# EAGLE design AstroEQ SMD V4.8 (EQ5) (EAGLE 6.6.0)
REVISION: V4.8
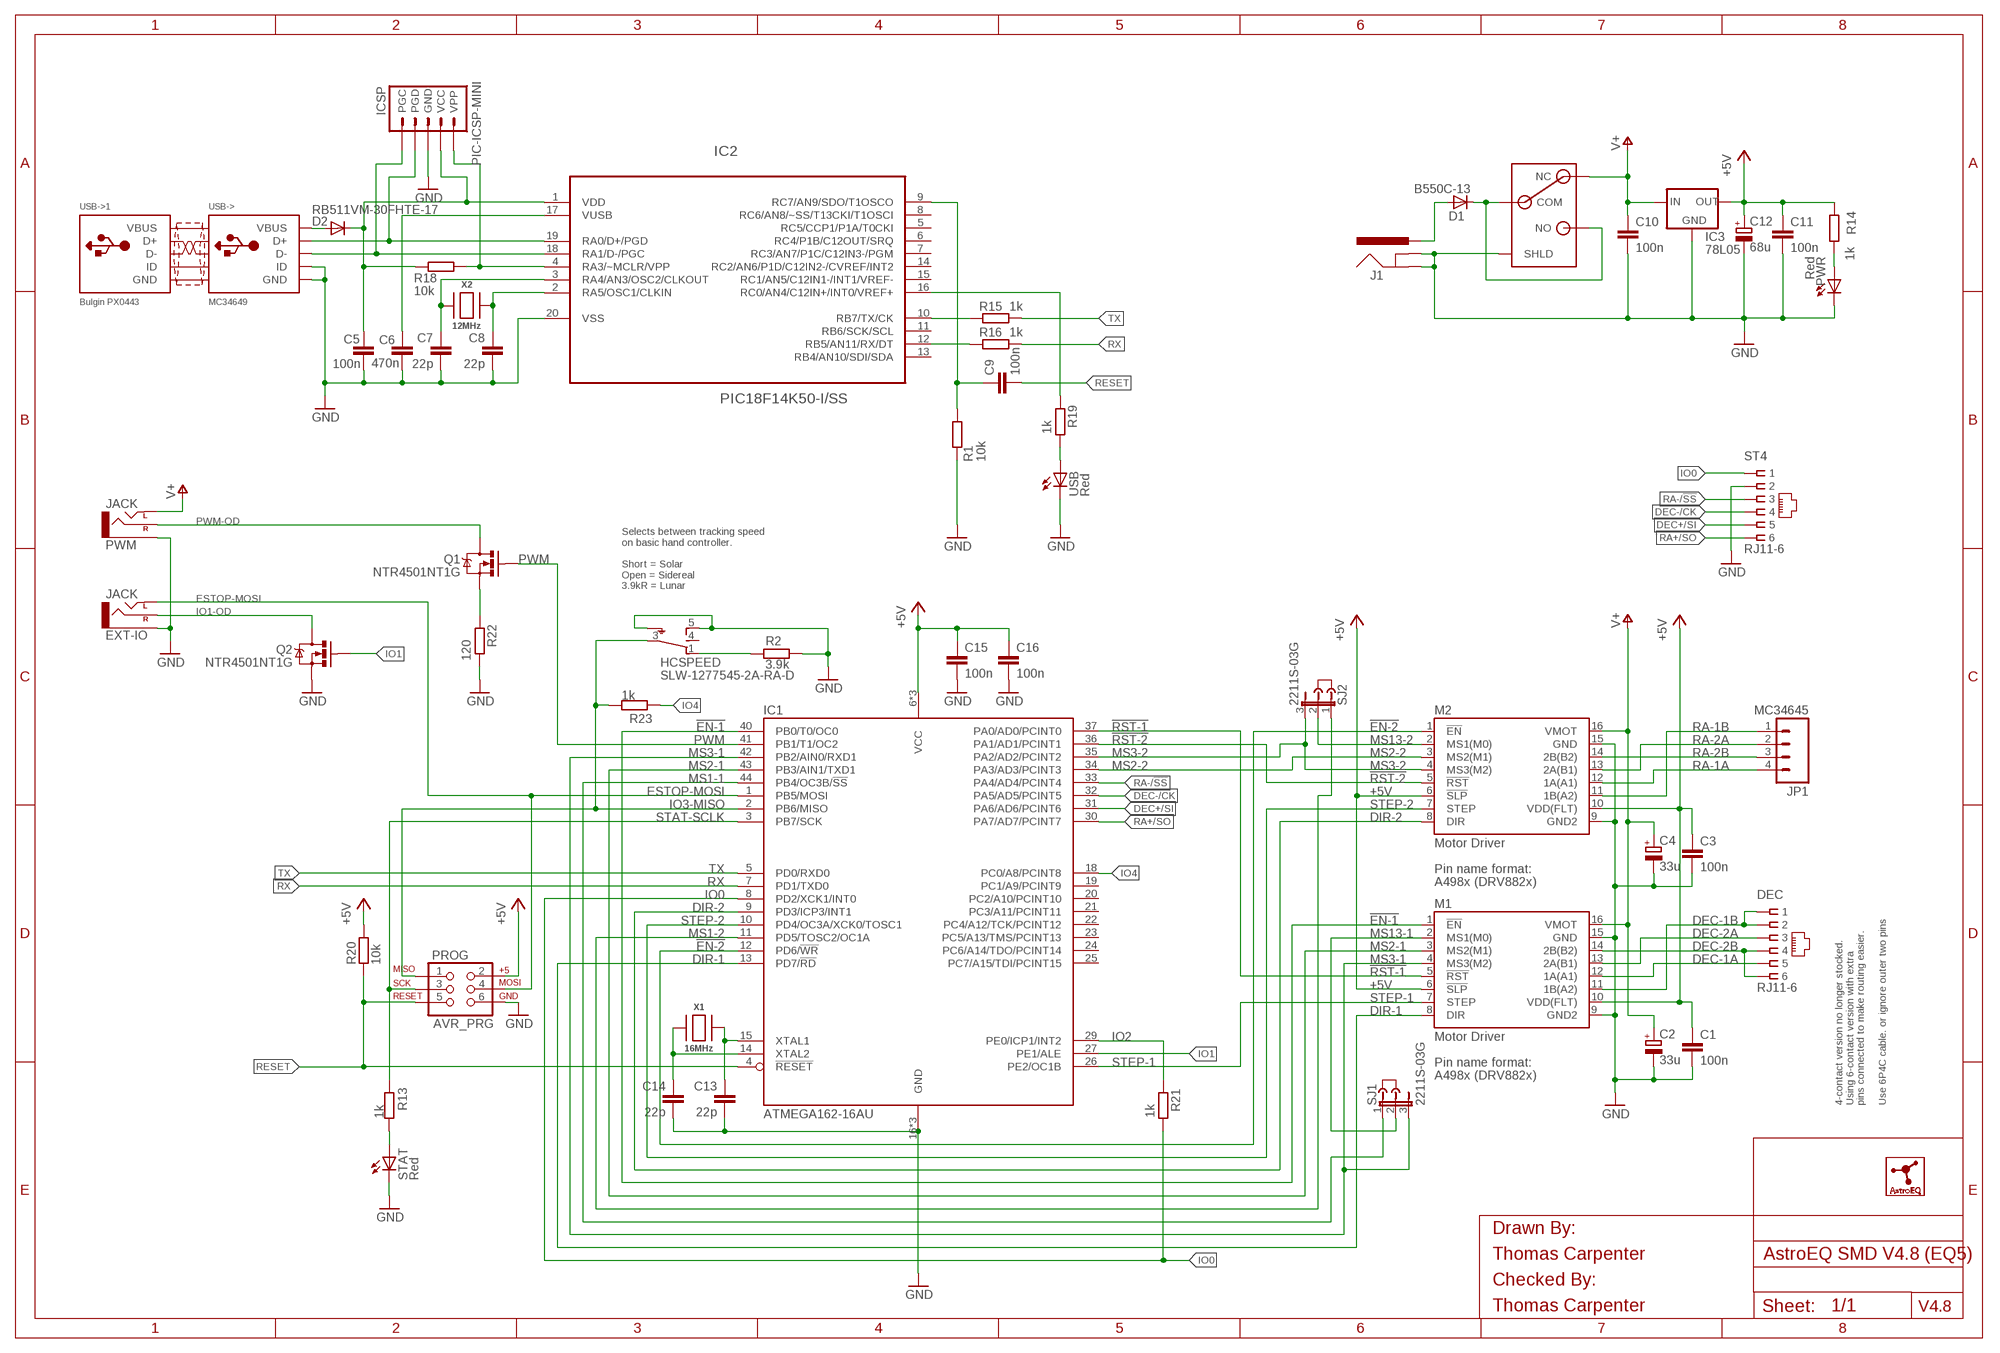
[diagram p0: schematic, sheet 1]
FRAME1 (A3L-LOC): CHECKED_BY: Thomas Carpenter; DRAWN_BY: Thomas Carpenter
USB->1 (USB-PANEL): MF: BULGIN; MPN: PX0443; OC_FARNELL: 1229685

## Parts
C1  100n  C-EUC0603  [C0603]
C2  33u  CPOL-EUSMCC  [SMC_C]
C3  100n  C-EUC0603  [C0603]
C4  33u  CPOL-EUSMCC  [SMC_C]
C5  100n  C-EUC0603  [C0603]
C6  470n  C-EUC0603  [C0603]
C7  22p  C-EUC0603  [C0603]
C8  22p  C-EUC0603  [C0603]
C9  100n  C-EUC0603  [C0603]
C10  100n  C-EUC0603  [C0603]
C11  100n  C-EUC0603  [C0603]
C12  68u  CPOL-EUSMCC  [SMC_C]
C13  22p  C-EUC0603  [C0603]
C14  22p  C-EUC0603  [C0603]
C15  100n  C-EUC0603  [C0603]
C16  100n  C-EUC0603  [C0603]
D1  B550C-13  DIODE-SMC  [SMC]
D2  RB511VM-30FHTE-17  DIODESOD  [SOD-323]
DEC  RJ11-6  RJ11-2L-B  [RJ11-NO_SHIELD]
EXT-IO  JACK  AUDIO-JACKVERT  [AUDIO-JACK-3.5MM-VERT]
HCSPEED  SLW-1277545-2A-RA-D  [SLW-127]
IC1  ATMEGA162-16AU  [TQFP44]
IC2  PIC18F14K50-I/SS  [SS20]
IC3  78L05  78LXXSOT-23  [SOT23]
ICSP  PIC-ICSP-MINI  [PIC-ICSP-MINI]
J1  POWER_JACKPANEL  [POWER_JACK_PANEL]
J2  DNI  JUMPER  [JUMP]
J3  DNI  JUMPER  [JUMP]
JP1  MC34645  M04POLAR  [MOLEX-1X4]
LOGO1  ASTROEQ5MM  [ASTROEQ-SMALL]
M1  Motor Driver  A4983CARRIER  [DIP16-W]
M2  Motor Driver  A4983CARRIER  [DIP16-W]
PROG  AVR_PRG  AVR_SPI_PRG_6PTH  [2X3]
PWM  JACK  AUDIO-JACKVERT  [AUDIO-JACK-3.5MM-VERT]
PWR  Red  LED3MM  [LED3MM]
PWR-SW  SWITCH  [SPST]
Q1  NTR4501NT1G  MOSFET-NCHANNELSMD  [SOT23-3]
Q2  NTR4501NT1G  MOSFET-NCHANNELSMD  [SOT23-3]
R1  10k  R-EU_R0603  [R0603]
R2  3.9k  R-EU_R0603  [R0603]
R13  1k  R-EU_R0603  [R0603]
R14  1k  R-EU_R0603  [R0603]
R15  1k  R-EU_R0603  [R0603]
R16  1k  R-EU_R0603  [R0603]
R18  10k  R-EU_R0603  [R0603]
R19  1k  R-EU_R0603  [R0603]
R20  10k  R-EU_R0603  [R0603]
R21  1k  R-EU_R0603  [R0603]
R22  120  R-EU_R0805  [R0805]
R23  1k  R-EU_R0603  [R0603]
SJ1  2211S-03G  JP2E  [JP2]
SJ2  2211S-03G  JP2E  [JP2]
ST4  RJ11-6  RJ11-2L-B  [RJ11-NO_SHIELD]
STAT  Red  LED3MM  [LED3MM]
USB  Red  LED3MM  [LED3MM]
USB->  MC34649  USBBULGINWIRE  [22-23-2051]
X1  16MHz  XTALNX5032  [NX5032]
X2  12MHz  XTALNX5032  [NX5032]

## Nets
!EN-1: IC1.40(PB0/T0/OC0) M1.1(!EN)
!EN-2: IC1.12(PD6/!WR) M2.1(!EN)
!RST-1: IC1.37(PA0/AD0/PCINT0) M1.5(!RST)
!RST-2: IC1.36(PA1/AD1/PCINT1) M2.5(!RST)
+5V: C1.1 C3.1 C11.1 C12.+ C15.1 C16.1 IC1.6(VCC) IC1.17(VCC) IC1.38(VCC) IC3.1(OUT) M1.6(!SLP) M1.10(VDD(FLT)) M2.6(!SLP) M2.10(VDD(FLT)) PROG.2 R14.1 R20.2
AVROSC1: C13.1 IC1.15(XTAL1) X1.1
AVROSC2: C14.1 IC1.14(XTAL2) X1.2
D_N [usbdat]: IC2.18(RA1/D-/PGC) ICSP.5(PGC) USB->.2(D-)
D_P [usbdat]: IC2.19(RA0/D+/PGD) ICSP.4(PGD) USB->.3(D+)
DEC+/SI: IC1.31(PA6/AD6/PCINT6) ST4.5
DEC-1A: DEC.5 M1.12(1A(A1))
DEC-1B: DEC.1 DEC.2 M1.11(1B(A2))
DEC-2A: DEC.3 M1.13(2A(B1))
DEC-2B: DEC.4 DEC.6 M1.14(2B(B2))
DEC-/CK: IC1.32(PA5/AD5/PCINT5) ST4.4
DIR-1: IC1.13(PD7/!RD) M1.8(DIR)
DIR-2: IC1.9(PD3/ICP3/INT1) M2.8(DIR)
DTR: C9.1 IC2.9(RC7/AN9/SDO/T1OSCO) R1.1
ESTOP-MOSI: EXT-IO.2(LEFT) IC1.1(PB5/MOSI) PROG.4
GND: C1.2 C2.- C3.2 C4.- C5.2 C6.1 C7.2 C8.2 C10.2 C11.2 C12.- C13.2 C14.2 C15.2 C16.2 EXT-IO.1(SLEEVE) HCSPEED.5(O) HCSPEED.S1(SH) HCSPEED.S2(SH) IC1.16(GND) IC1.28(GND) IC1.39(GND) IC2.20(VSS) IC3.3(GND) ICSP.3(GND) J1.SHUNT(GNDBREAK) J1.SLEEVE(GND) M1.9(GND2) M1.15(GND) M2.9(GND2) M2.15(GND) PROG.6 PWM.1(SLEEVE) PWR-SW.S1(SHLD) PWR-SW.S2(SHLD) PWR-SW.S3(SHLD) PWR-SW.S4(SHLD) PWR.K(C) Q2.2(S) R1.2 R2.2 R22.1 ST4.2 STAT.K(C) USB->.4(GND) USB->.5(ID) USB.K(C)
IO0: IC1.8(PD2/XCK1/INT0) R21.1 ST4.1
IO1: IC1.27(PE1/ALE) Q2.1(G)
IO1-OD: EXT-IO.3(RIGHT) Q2.3(D)
IO2: IC1.29(PE0/ICP1/INT2) R21.2
IO3-MISO: HCSPEED.3(P) IC1.2(PB6/MISO) PROG.1 R23.2
IO4: IC1.18(PC0/A8/PCINT8) R23.1
MCLR: IC2.4(RA3/~MCLR/VPP) ICSP.1(VPP) R18.1
MS1-1: IC1.44(PB4/OC3B/!SS) SJ1.1
MS1-2: IC1.11(PD5/TOSC2/OC1A) SJ2.1
MS2-1: IC1.43(PB3/AIN1/TXD1) M1.3(MS2(M1))
MS2-2: IC1.34(PA3/AD3/PCINT3) M2.3(MS2(M1))
MS3-1: IC1.42(PB2/AIN0/RXD1) M1.4(MS3(M2)) SJ1.3
MS3-2: IC1.35(PA2/AD2/PCINT2) M2.4(MS3(M2)) SJ2.3
MS13-1: M1.2(MS1(M0)) SJ1.2
MS13-2: M2.2(MS1(M0)) SJ2.2
N$1: HCSPEED.1(S) R2.1
PWM: IC1.41(PB1/T1/OC2) Q1.1(G)
PWM-OD: PWM.3(RIGHT) Q1.3(D)
PWM-RES: Q1.2(S) R22.2
PWRLED: PWR.A R14.2
RA+/SO: IC1.30(PA7/AD7/PCINT7) ST4.6
RA-1A: JP1.4 M2.12(1A(A1))
RA-1B: JP1.1 M2.11(1B(A2))
RA-2A: JP1.2 M2.13(2A(B1))
RA-2B: JP1.3 M2.14(2B(B2))
RA-/!SS: IC1.33(PA4/AD4/PCINT4) ST4.3
RESET: C9.2 IC1.4(!RESET) PROG.5 R20.1
RX: IC1.7(PD1/TXD0) R16.1
RX(USB): IC2.12(RB5/AN11/RX/DT) R16.2
STAT-SCLK: IC1.3(PB7/SCK) PROG.3 R13.1
STATLED: R13.2 STAT.A
STEP-1: IC1.26(PE2/OC1B) M1.7(STEP)
STEP-2: IC1.10(PD4/OC3A/XCK0/TOSC1) M2.7(STEP)
SWITCH: D1.C PWR-SW.COM PWR-SW.NO
TX: IC1.5(PD0/RXD0) R15.1
TX(USB): IC2.10(RB7/TX/CK) R15.2
USBLED: R19.1 USB.A
USBOSC1: C8.1 IC2.2(RA5/OSC1/CLKIN) X2.2
USBOSC2: C7.1 IC2.3(RA4/AN3/OSC2/CLKOUT) X2.1
USBSTAT: IC2.16(RC0/AN4/C12IN+/INT0/VREF+) R19.2
V+: C2.+ C4.+ C10.1 IC3.2(IN) M1.16(VMOT) M2.16(VMOT) PWM.2(LEFT) PWR-SW.NC
VBUS: D2.2(A) USB->.1(VBUS)
VIN: D1.A J1.CENTRE(PWR)
VPIC: C5.1 D2.1(C) IC2.1(VDD) ICSP.2(VCC) R18.2
VUSB: C6.2 IC2.17(VUSB)
Unconnected: HCSPEED.4(M) IC1.19(PC1/A9/PCINT9) IC1.20(PC2/A10/PCINT10) IC1.21(PC3/A11/PCINT11) IC1.22(PC4/A12/TCK/PCINT12) IC1.23(PC5/A13/TMS/PCINT13) IC1.24(PC6/A14/TDO/PCINT14) IC1.25(PC7/A15/TDI/PCINT15) IC2.5(RC5/CCP1/P1A/T0CKI) IC2.6(RC4/P1B/C12OUT/SRQ) IC2.7(RC3/AN7/P1C/C12IN3-/PGM) IC2.8(RC6/AN8/~SS/T13CKI/T1OSCI) IC2.11(RB6/SCK/SCL) IC2.13(RB4/AN10/SDI/SDA) IC2.14(RC2/AN6/P1D/C12IN2-/CVREF/INT2) IC2.15(RC1/AN5/C12IN1-/INT1/VREF-)

## Notes on the sheet
- Selects between tracking speed
  on basic hand controller.
  
  Short = Solar
  Open = Sidereal
  3.9kR = Lunar
- 4-contact version no longer stocked.
  Using 6-contact version with extra
  pins connected to make routing easier.
  
  Use 6P4C cable. or ignore outer two pins

## Library data of the parts
C1 C3 C5 C9-C11 C15 C16 = rcl:C-EU: CAPACITOR, European symbol; MF: MULTICOMP; MPN: MC0603F104Z250CT; OC_FARNELL: 1759038
C2 C4 = rcl:CPOL-EU: POLARIZED CAPACITOR, European symbol; MF: KEMET; MPN: T491C336K025AT; OC_FARNELL: 1793896
C6 = rcl:C-EU: CAPACITOR, European symbol; MF: MULTICOMP; MPN: MC0603F474Z160CT; OC_FARNELL: 1759021
C7 C8 C13 C14 = rcl:C-EU: CAPACITOR, European symbol; MF: MULTICOMP; MPN: MC0603N220J500CT; OC_FARNELL: 1759057
C12 = rcl:CPOL-EU: POLARIZED CAPACITOR, European symbol; MF: AVX; MPN: TPSC686K016R0125; OC_FARNELL: 1658976
D1 = diode:DIODE-: DIODE; MF: DIODES INC.; MPN: B550C-13-F; OC_FARNELL: 1858608
D2 = SparkFun:DIODE: Diode These are standard reverse protection diodes and small signal diodes. SMA package can handle up to about 1A. SOD-323 can handle about 200mA. What the SOD-323 package when ordering, there are some mfgs out there that are 5-pin packages.; MF: ROHM; MPN: RB511VM-30FHTE-17; OC_FARNELL: 2581544
DEC ST4 = con-tycoelectronics:RJ11: CORCOM Modular RJ Jacks No Shield Source: www.tycoelectronics.com .. ENG_DS_1654001_1099_RJ_L_0507.pdf; MF: MOLEX; MPN: 95503-2661; OC_FARNELL: 1620210
EXT-IO PWM = SparkFun:AUDIO-JACK: 3.5mm Audio Jack Simple 3.5mm common PCB mount audio jack. SKU: PRT-08032; MANUFACTURER: LUMBERG; MF: LUMBERG; MPN: 1502 01; OC_FARNELL: 1243242
HCSPEED = switch:SLW-127
IC1 = atmel:ATMEGA162: 8-bit RISC MICROCONTROLLER 16K Bytes internal flash program memory 1K Bytes internal SRAM Upto 64K Bytes optional external memory space 512 Bytes EEPROM Two 8-bit timers Two 16-bit timers Dual programmable serial USARTs Master/Slave serial SPI interface Source: ATMEGA162_DIP40.lbr; MF: ATMEL; MPN: ATMEGA162-16AU; OC_FARNELL: 9171150
IC2 = microchip:PIC18F14K50: USB Flash Microcontrollers; MF: MICROCHIP
IC3 = v-reg:78LXX: VOLTAGE REGULATOR; MF: TAIWAN SEMICONDUCTOR; MPN: TS78L05CX RFG; OC_FARNELL: 1476698
ICSP = SparkFun:PIC-ICSP-MINI: PIC-ICSP-Mini Miniature 5-pin connection for temporary programming of PICs. Use this device in your design to save space. Program the PIC with this adapter Spark Fun Electronics SKU : BOB-00194; OC_FARNELL: unknown
J1 = SparkFun:POWER_JACK: Power Jack This is the standard 5.5mm barrel jack for power. The PTH is the most common, proven, reliable, footprint. All others are experimental. The Slot footprint only works if the mill layer is transmitted to the PCB fab house so be warned. Spark Fun Electronics SKU : PRT-00119. Mating wall wart : TOL-00298 (and others); MF: SWITCHCRAFT; MPN: PCL712AS; OC_FARNELL: 1871167
J2 J3 = jumper:JUMPER: JUMPER header; MF: 3M; MPN: 969102-0000-DA; OC_FARNELL: 2579814
JP1 = SparkFun:M04: Header 4 Standard 4-pin 0.1" header. Use with straight break away headers (SKU : PRT-00116), right angle break away headers (PRT-00553), swiss pins (PRT-00743), machine pins (PRT-00117), and female headers (PRT-00115). Molex polarized connector foot print use with SKU : PRT-08231 with associated crimp pins and housings. 1MM SMD Version SKU: PRT-10208; MF: MULTICOMP; MPN: MC34645; OC_FARNELL: 1675775
LOGO1 = AstroEQTooth:ASTROEQ; OC_FARNELL: unknown
M1 M2 = A4983Carrier:A4983CARRIER; MF: SAMTEC; MPN: CES-116-01-T-S; OC_FARNELL: 1667522
PROG = SparkFun:AVR_SPI_PRG_6: AVR ISP 6 Pin This is the reduced ISP connector for AVR programming. Common on Arduino. This footprint will take up less PCB space and can be used with a 10-pin to 6-pin adapter such as SKU: BOB-08508; MF: AMP - TE CONNECTIVITY; MPN: 826632-3; OC_FARNELL: 3418492
PWR STAT USB = led:LED: LED OSRAM: - CHIPLED LG R971, LG N971, LY N971, LG Q971, LY Q971, LO R971, LY R971 LH N974, LH R974 LS Q976, LO Q976, LY Q976 LO Q996 - Hyper CHIPLED LW Q18S LB Q993, LB Q99A, LB R99A - SideLED LS A670, LO A670, LY A670, LG A670, LP A670 LB A673, LV A673, LT A673, LW A673 LH A674 LY A675 LS A676, LA A676, LO A676, LY A676, LW A676 LS A679, LY A679, LG A679 - Hyper Micro SIDELED® LS Y876, LA Y876, LO Y876, LY Y876 LT Y87S - SmartLED LW L88C, LW L88S LB L89C, LB L89S, LG L890 LS L89K, LO L89K, LY L89K LS L896, LA L896, LO L896, LY L896 - TOPLED LS T670, LO T670, LY T670, LG T670, LP T670 LSG T670, LSP T670, LSY T670, LOP T670, LYG T670 LG T671, LOG T671, LSG T671 LB T673, LV T673, LT T673, LW T673 LH T674 LS T676, LA T676, LO T676, LY T676, LB T676, LH T676, LSB T676, LW T676 LB T67C, LV T67C, LT T67C, LS T67K, LO T67K, LY T67K, LW E67C LS E67B, LA E67B, LO E67B, LY E67B, LB E67C, LV E67C, LT E67C LW T67C LS T679, LY T679, LG T679 LS T770, LO T770, LY T770, LG T770, LP T770 LB T773, LV T773, LT T773, LW T773 LH T774 LS E675, LA E675, LY E675, LS T675 LS T776, LA T776, LO T776, LY T776, LB T776 LHGB T686 LT T68C, LB T68C - Hyper Mini TOPLED® LB M676 - Mini TOPLED Santana® LG M470 LS M47K, LO M47K, LY M47K Source: http://www.osram.convergy.de LUXEON: - LUMILED® LXK2-PW12-R00, LXK2-PW12-S00, LXK2-PW14-U00, LXK2-PW14-V00 LXK2-PM12-R00, LXK2-PM12-S00, LXK2-PM14-U00 LXK2-PE12-Q00, LXK2-PE12-R00, LXK2-PE12-S00, LXK2-PE14-T00, LXK2-PE14-U00 LXK2-PB12-K00, LXK2-PB12-L00, LXK2-PB12-M00, LXK2-PB14-N00, LXK2-PB14-P00, LXK2-PB14-Q00 LXK2-PR12-L00, LXK2-PR12-M00, LXK2-PR14-Q00, LXK2-PR14-R00 LXK2-PD12-Q00, LXK2-PD12-R00, LXK2-PD12-S00 LXK2-PH12-R00, LXK2-PH12-S00 LXK2-PL12-P00, LXK2-PL12-Q00, LXK2-PL12-R00 Source: www.luxeon.com KINGBRIGHT: KA-3528ASYC Source: www.kingbright.com; MF: KINGBRIGHT; MPN: L-424HDT; OC_FARNELL: 1142499
PWR-SW = con-tycoelectronics:SWITCH; MF: TE CONNECTIVITY; MPN: AE101J1V3B004; OC_FARNELL: 1813654
Q1 Q2 = SparkFun:MOSFET-NCHANNEL; MF: ON SEMICONDUCTOR; MPN: NTR4501NT1G; OC_FARNELL: 1431305
R1 R18 R20 = rcl:R-EU_: RESISTOR, European symbol; MF: MULTICOMP; MPN: MCWR06X1002FTL; OC_FARNELL: 2447230
R2 R13-R16 R19 R21 R23 = rcl:R-EU_: RESISTOR, European symbol; MF: MULTICOMP; MPN: MCWR06X1001FTL; OC_FARNELL: 2447272
R22 = rcl:R-EU_: RESISTOR, European symbol; MF: MULTICOMP; MPN: MCWR08X1200FTL; OC_FARNELL: 2447561
SJ1 SJ2 = jumper:JP2E: JUMPER; MF: MULTICOMP; MPN: 2211S-03G; OC_FARNELL: 1593412
USB-> = adafruit:USB: USB Connectors USBMINIB - Surface Mount Female Mini-B USB Connector 4UConnector: 06564 By microbuilder.eu Thru-hole RA Female Mini-B USB Connector 4UConnector: 18732 By ladyada.net; MF: MULTICOMP; MPN: MC34647; OC_FARNELL: 1675776
X1 = adafruit:XTAL: Low cost SMT crystals, no capacitors included http://www.ladyada.net/library/eagle; MF: TXC; MPN: 7A-16.000MAAJ-T; OC_FARNELL: 1841946
X2 = adafruit:XTAL: Low cost SMT crystals, no capacitors included http://www.ladyada.net/library/eagle; MF: TXC; MPN: 7A-12.000MAAJ-T; OC_FARNELL: 1841940

## Net classes
1 power: width 0.61 mm, drill 0.711 mm, clearance 0.203 mm
2 gnd: width 0.305 mm, drill 0.711 mm, clearance 0.203 mm
3 usbvcc: width 0.508 mm, drill 0.711 mm, clearance 0.203 mm
4 usbdat: width 0.406 mm, clearance 0.152 mm

## Board
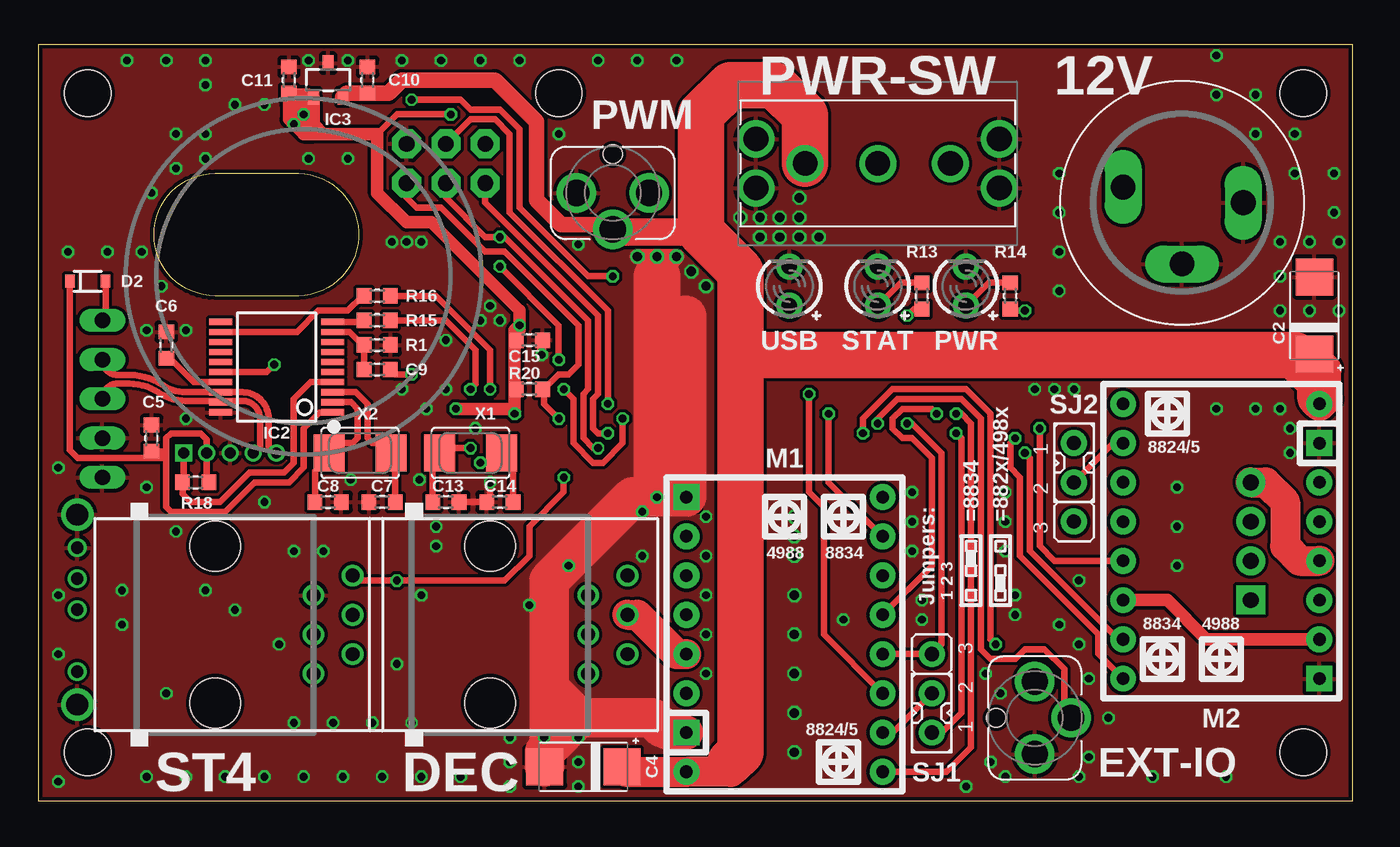
[diagram p1: board, top side]
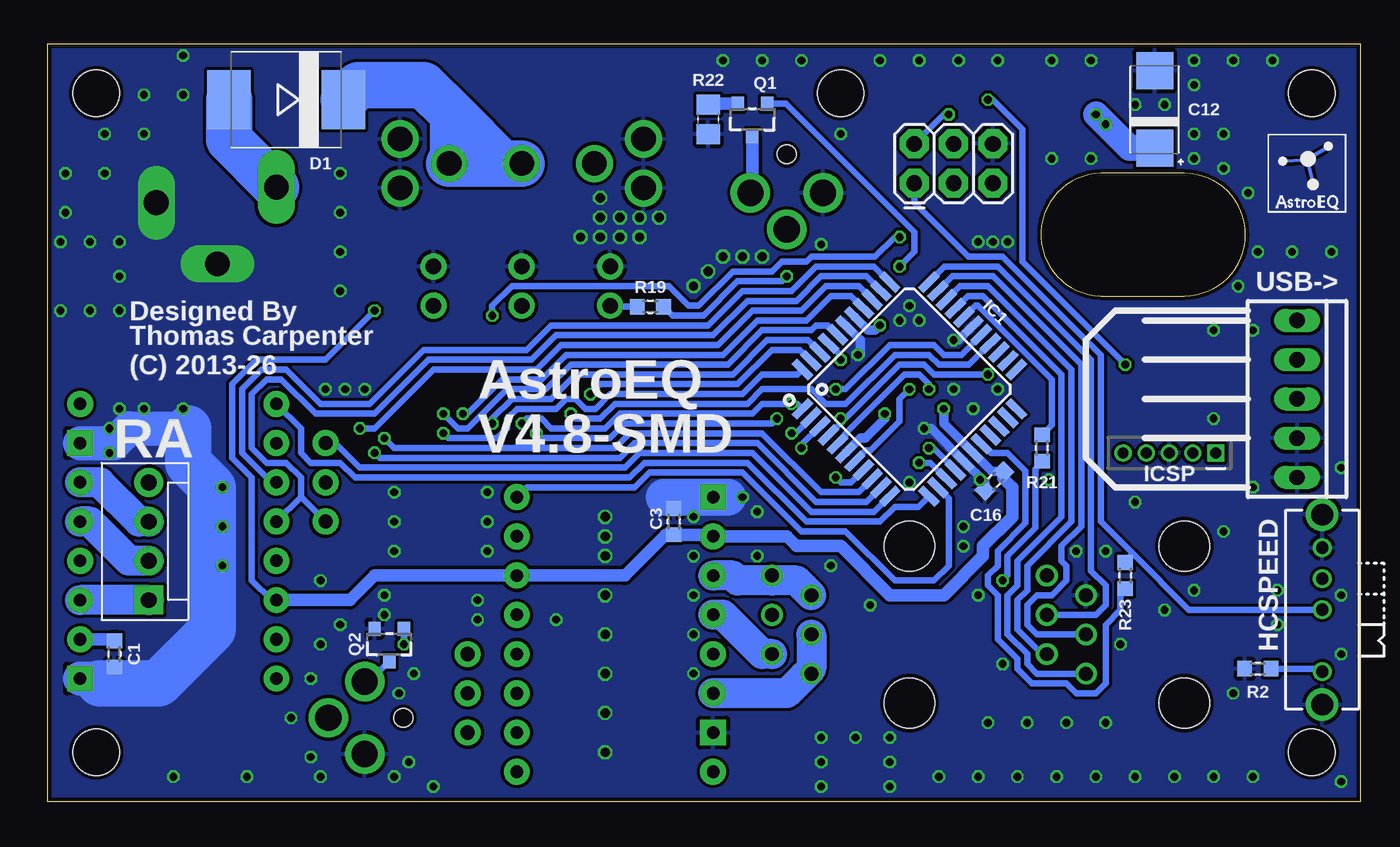
[diagram p2: board, bottom side, seen from below]

Size 85 x 49 mm. Coordinates in mm from the lower left corner, seen from the top.
Outline: 0,0 0,49 85,49 85,0 0,0
Outline: 16.83,40.64 arc-177 16.83,32.7 11.43,32.7 arc-180 11.43,40.64 16.83,40.64
Copper layers (1*16): Top 0.035mm / dielectric 1.5mm / Bottom 0.035mm
Design rules "ITEADstudio_DRC *": minimum track width 6mil, minimum drill 12mil, track to track 6mil, track to pad 6mil, pad to pad 6mil, via to via 6mil, smd to smd 0mil, copper to edge 10mil, drill to drill 10mil, minimum pad ring 8mil, minimum via ring 6mil, stop-mask expansion 2mil, vias tented up to drill 1mm, thermal gap 10mil
Holes 3 mm at 81.83,3.17 33.66,45.83 3.17,45.83 81.83,45.83 3.17,3.17
bKeepout: area 48.3,7.4 to 53.3,12.4

### Footprints (pad centres in the part's own frame; a part is rotated, then mirrored left to right if it is on the bottom)
C0603 = smd 0.95 x 1: 1 -0.85,0; 2 0.85,0
SMC_C = smd 2.4 x 2.4: + -2.5,0; - 2.5,0
SMC = smd 2.8 x 3.8: A 3.7,0; C -3.7,0
SOD-323 = smd 0.63 x 0.83: 1 -1.15,0; 2 1.15,0
RJ11-NO_SHIELD = drill 0.9 pad 1.4: 1 -3.175,8.89; 2 -1.905,6.35; 3 -0.635,8.89; 4 0.635,6.35; 5 1.905,8.89; 6 3.175,6.35 | hole 3.251: -5.08,0; 5.08,0
AUDIO-JACK-3.5MM-VERT = drill 1.7: 1 2.35,0; 2 0,2.35; 3 -2.35,0 | hole 1.2: 0,-2.5
SLW-127 = drill 0.8: 1 -4,0; 3 0,0; 4 2,0; 5 4,0 | drill 1.4: S1 -6.15,0; S2 6.15,0
TQFP44 = smd 1.5 x 0.5: 1 -5.8,4; 2 -5.8,3.2; 3 -5.8,2.4; 4 -5.8,1.6; 5 -5.8,0.8; 6 -5.8,0; 7 -5.8,-0.8; 8 -5.8,-1.6; 9 -5.8,-2.4; 10 -5.8,-3.2; 11 -5.8,-4; 23 5.8,-4; 24 5.8,-3.2; 25 5.8,-2.4; 26 5.8,-1.6; 27 5.8,-0.8; 28 5.8,0; 29 5.8,0.8; 30 5.8,1.6; 31 5.8,2.4; 32 5.8,3.2; 33 5.8,4 | smd 0.5 x 1.5: 12 -4,-5.8; 13 -3.2,-5.8; 14 -2.4,-5.8; 15 -1.6,-5.8; 16 -0.8,-5.8; 17 0,-5.8; 18 0.8,-5.8; 19 1.6,-5.8; 20 2.4,-5.8; 21 3.2,-5.8; 22 4,-5.8; 34 4,5.8; 35 3.2,5.8; 36 2.4,5.8; 37 1.6,5.8; 38 0.8,5.8; 39 0,5.8; 40 -0.8,5.8; 41 -1.6,5.8; 42 -2.4,5.8; 43 -3.2,5.8; 44 -4,5.8
SS20 = smd 0.4 x 1.5: 1 -2.925,-3.625; 2 -2.275,-3.625; 3 -1.625,-3.625; 4 -0.975,-3.625; 5 -0.325,-3.625; 6 0.325,-3.625; 7 0.975,-3.625; 8 1.625,-3.625; 9 2.275,-3.625; 10 2.925,-3.625; 11 2.925,3.625; 12 2.275,3.625; 13 1.625,3.625; 14 0.975,3.625; 15 0.325,3.625; 16 -0.325,3.625; 17 -0.975,3.625; 18 -1.625,3.625; 19 -2.275,3.625; 20 -2.925,3.625
SOT23 = smd 0.7 x 1: 1 -0.95,-1.1; 2 0.95,-1.1; 3 0,1.1
PIC-ICSP-MINI = drill 0.7 square: 1 -3,0 | drill 0.7: 2 -1.5,0; 3 0,0; 4 1.5,0; 5 3,0
POWER_JACK_PANEL = drill 1.6 long: CENTRE 3.81,-1.016; SHUNT -3.962,0; SLEEVE 0,3.962
MOLEX-1X4 = drill 1.016 pad 1.88 square: 1 0,0 | drill 1.016 pad 1.88: 2 2.54,0; 3 5.08,0; 4 7.62,0
DIP16-W = drill 0.813 pad 1.676: 1 -8.89,-6.35; 2 -6.35,-6.35; 3 -3.81,-6.35; 4 -1.27,-6.35; 5 1.27,-6.35; 6 3.81,-6.35; 7 6.35,-6.35; 8 8.89,-6.35; 10 6.35,6.35; 11 3.81,6.35; 12 1.27,6.35; 13 -1.27,6.35; 14 -3.81,6.35; 16 -8.89,6.35 | drill 0.813 pad 1.676 square: 9 8.89,6.35; 15 -6.35,6.35
2X3 = drill 1.016 pad 1.88 octagon: 1 -2.54,-1.27; 2 -2.54,1.27; 3 0,-1.27; 4 0,1.27; 5 2.54,-1.27; 6 2.54,1.27
LED3MM = drill 1 pad 1.676: A -1.27,0; K 1.27,0
SPST = drill 1.6: COM 0,0; NC -4.699,0; NO 4.699,0; S1 7.874,1.587; S2 7.874,-1.587; S3 -7.874,1.587; S4 -7.874,-1.587
SOT23-3 = smd 0.8 x 0.9: 1 -0.95,-1; 2 0.95,-1; 3 0,1.1
R0603 = smd 0.95 x 1: 1 -0.85,0; 2 0.85,0
R0805 = smd 1.3 x 1.5: 1 -0.95,0; 2 0.95,0
JP2 = drill 0.914 pad 1.676: 1 -2.54,0; 2 0,0; 3 2.54,0
22-23-2051 = drill 1 long: 1 -5.08,0; 2 -2.54,0; 3 0,0; 4 2.54,0; 5 5.08,0
NX5032 = smd 2 x 2.4: 1 2,0; 2 -2,0

### Placement (x,y rotation side)
C1  80.64,9.53 270 bottom
C2  82.55,31.43 90 top
C3  44.45,18.1 90 bottom
C4  35.24,2.22 180 top
C5  7.3,23.5 90 top
C6  8.26,29.53 270 top
C7  22.23,19.37 180 top
C8  18.73,19.37 0 top
C9  21.91,27.94 0 top
C10  21.27,46.67 90 top
C11  16.19,46.67 90 top
C12  13.34,44.77 90 bottom
C13  26.35,19.37 0 top
C14  29.84,19.37 180 top
C15  31.75,29.84 0 top
C16  23.72,20.73 225 bottom
D1  69.53,45.4 180 bottom
D2  3.17,33.66 0 top
DEC  29.21,11.43 270 top
EXT-IO  64.45,5.4 270 top
HCSPEED  2.5,12.4 90 bottom
IC1  29.21,26.67 45 bottom
IC2  15.4,28.1 90 top
IC3  18.73,46.67 0 top
ICSP  12.38,22.54 180 bottom
J1  73.98,38.73 180 top
J2  57.78,5.71 0 top
J3  66.99,21.91 0 top
JP1  78.42,13.02 90 bottom
LOGO1  6.03,38.1 0 bottom
M1  48.26,10.79 90 top
M2  76.52,16.83 270 top
PROG  26.35,41.27 0 bottom
PWM  37.15,39.37 180 top
PWR  60.01,33.34 90 top
PWR-SW  54.29,41.27 0 top
Q1  39.37,44.13 180 bottom
Q2  62.87,10.16 180 bottom
R1  21.91,29.53 0 top
R2  6.67,8.57 180 bottom
R13  57.15,32.7 90 top
R14  62.87,32.7 90 top
R15  21.91,31.11 180 top
R16  21.91,32.7 180 top
R18  10.16,20.64 0 top
R19  45.97,32 0 bottom
R20  31.75,26.67 180 top
R21  20.64,22.86 90 bottom
R22  42.23,44.13 90 bottom
R23  15.24,14.61 90 bottom
SJ1  57.78,6.99 90 top
SJ2  66.99,20.64 270 top
ST4  11.43,11.43 270 top
STAT  54.29,33.34 90 top
USB  48.58,33.34 90 top
USB->  4.13,26.04 270 bottom
X1  27.94,22.54 180 top
X2  20.8,22.54 0 top

### Tracks (layer width: path | path; a pad name or v marks a point on that pad's centre or on a via)
!EN-1  (via drill 0.5)
  Top 0.406: M1.1 58.74,1.91 60.33,3.49 60.33,24.45 59.69,25.08 v59.37,25.08
  Bottom 0.406: IC1.40 34.47,30.8 35.24,30.8 35.56,30.48 38.73,30.48 40.96,28.26 51.12,28.26 52.7,26.67 55.24,26.67 57.78,24.13 58.42,24.13 v59.37,25.08
!EN-2
  Bottom 0.406: IC1.12 28.63,19.05 30.16,19.05 31.11,18.1 35.88,18.1 39.69,21.91 46.35,21.91 47.31,20.95 65.09,20.95 66.04,21.91 67.94,21.91 68.58,22.54 68.58,24.13 M2.1
!RST-1  (via drill 0.5)
  Top 0.406: M1.5 57.78,15.24 57.78,22.23 56.52,23.5 55.88,23.5 55.24,24.13 55.24,24.77 55.88,25.4 57.78,25.4 v58.1,25.08
  Bottom 0.406: IC1.37 32.98,32.7 34.29,32.7 35.88,31.11 39.05,31.11 41.27,28.89 51.44,28.89 53.02,27.3 55.56,27.3 57.78,25.08 v58.1,25.08
!RST-2  (via drill 0.5)
  Top 0.406: M2.5 65.72,15.56 64.77,16.51 v64.77,24.13
  Bottom 0.406: IC1.36 32.48,33.34 34.61,33.34 36.2,31.75 39.37,31.75 41.59,29.53 51.75,29.53 53.34,27.94 60.01,27.94 63.82,24.13 v64.77,24.13
+5V  (via drill 0.5)
  Top 0.406: 31.11,30.48 30.8,30.48 | v26.67,44.45 23.18,44.45 21.91,43.18 | R14.1 62.97,31.75 v63.82,31.75
  Top 0.813: R20.2 30.8,26.67 | v26.99,25.4 30.8,25.4 | 30.8,25.4 v30.8,25.08 | 30.8,29.84 30.8,26.67 | 30.8,26.67 30.8,25.4 | v31.11,30.8 30.8,30.48 30.8,29.84 | 30.8,29.84 C15.1 | v31.11,30.8 31.11,31.75 25.4,37.47 23.81,37.47 21.91,39.37 21.91,43.18 18.41,43.18 | v31.11,30.8 31.11,30.48 | M2.6 73.03,13.02 75.56,10.48 M2.10 | 18.41,43.18 17.78,43.81 | 17.78,43.81 IC3.1 | 16.19,45.4 C11.1 16.41,45.82 16.51,45.72 | 16.19,45.4 16.83,44.77 16.83,44.45 16.19,45.09 | 16.19,45.09 16.19,45.4 | 16.19,45.09 16.19,44.13 v16.51,43.81 17.14,43.18 17.78,43.18 | 18.41,43.18 17.78,43.18 | 17.78,43.18 17.14,43.81 v17.14,44.45 17.78,43.81 | 16.51,45.72 17.78,44.45 17.78,45.4 17.46,45.72 16.51,45.72
  Bottom 0.406: PROG.2 26.99,44.45 v26.67,44.45 | v63.82,31.75 66.99,28.57 71.44,28.57 73.03,26.99 73.03,22.23 71.75,20.95 71.75,14.29 70.48,13.02 M2.6
  Bottom 0.61: C16.1 23.87,21.33 IC1.17 26.99,24.45 v26.99,25.4 | v30.8,25.08 30.8,24.77 32.07,23.5 32.38,23.5 IC1.6 | IC1.38 31.89,30.48 31.43,30.48 v31.11,30.8
  Bottom 0.813: C16.1 23.12,20.9 22.54,20.32 22.54,18.41 24.45,16.51 24.45,15.88 26.99,13.34 30.48,13.34 33.66,16.51 36.51,16.51 37.15,17.14 M1.10 42.01,17.25 C3.1 44.98,17.25 47.62,14.61 M1.6 63.82,14.61 65.41,13.02 M2.6 | 80.54,10.48 C1.1 80.75,10.48 M2.10
  Bottom 1.676: C12.+ 14.96,42.27 v17.14,44.45
AVROSC1  (via drill 0.5)
  Top 0.406: v27.94,22.86 26.26,22.86 X1.1 25.5,22.11 C13.1
  Bottom 0.406: IC1.15 27.66,22.86 v27.94,22.86
AVROSC2  (via drill 0.5)
  Top 0.406: v28.57,21.91 29.3,21.91 X1.2 30.7,21.79 C14.1
  Bottom 0.406: IC1.14 27.84,21.91 v28.57,21.91
D_N
  Top 0.406: USB->.2 arc90 5.12,27.58 5.87,27.58 arc-34 8.1,26.9 arc35 9.52,26.47 IC2.18 | ICSP.5 arc-90 14.88,23.04 14.88,24.77 arc90 13.18,26.47 IC2.18 | IC2.18
D_P
  Top 0.406: USB->.3 arc-90 5.12,27.03 5.87,27.03 arc-34 7.78,26.44 arc35 9.53,25.91 11.77,25.91 | ICSP.4 arc90 14.33,22.99 14.33,24.77 arc90 13.18,25.91 11.77,25.91 | IC2.19 11.77,25.91
DEC+/SI
  Bottom 0.406: IC1.31 25.94,33.34 24.13,33.34 18.73,27.94 18.73,18.1 21.59,15.24 21.59,13.65 22.23,13.02 22.23,11.11 20.64,9.53 ST4.5
DEC-1A
  Bottom 1.93: DEC.5 38.73,9.53 41.27,12.06 M1.12
DEC-1B
  Bottom 0.406: DEC.1 38.1,14.29
  Bottom 1.93: DEC.2 36.51,14.29 38.1,14.29 40.32,14.29 40.64,14.61 M1.11
DEC-2A
  Top 1.93: DEC.3 38.73,12.06 41.27,9.53 M1.13
DEC-2B
  Bottom 0.406: DEC.6 36.04,8.26 36.04,8.1
  Bottom 1.93: DEC.4 35.56,8.57 36.04,8.1 37.15,6.99 M1.14
DEC-/CK
  Bottom 0.406: IC1.32 26.43,33.97 23.81,33.97 18.1,28.26 18.1,17.78 19.37,16.51 19.37,15.56 19.05,15.24 19.05,14.29 20,13.34 20.95,13.34 21.59,12.7 21.59,11.43 20.95,10.79 ST4.4
DIR-1
  Bottom 0.406: IC1.13 26.67,19.61 26.67,15.24 27.62,14.29 30.16,14.29 33.34,17.46 36.2,17.46 40.01,21.27 46.04,21.27 46.99,20.32 53.98,20.32 M1.8
DIR-2  (via drill 0.5)
  Top 0.406: M2.8 68.58,9.53 68.58,10.79 63.5,15.88 63.5,20.95 62.87,21.59 62.87,23.18 v63.18,23.5
  Bottom 0.406: IC1.9 32.48,20 34.92,20 38.73,23.81 47.31,23.81 48.26,22.86 62.55,22.86 v63.18,23.5
DTR
  Top 0.406: IC2.9 20.11,30.37 20.95,29.53 R1.1 C9.1
ESTOP-MOSI  (via drill 0.5)
  Top 0.406: v36.83,25.72 36.83,31.75 30.48,38.1 30.48,43.18 29.53,44.13 27.94,44.13 PROG.4 | v54.29,24.45 54.29,24.77 55.56,26.04 59.69,26.04 60.96,24.77 60.96,9.84 61.59,9.21 63.18,9.21 63.82,9.84 65.09,9.84 66.36,8.57 66.36,5.84 EXT-IO.2
  Bottom 0.406: IC1.1 36.46,25.72 v36.83,25.72 38.73,25.72 39.37,25.08 47.94,25.08 48.9,24.13 52.39,24.13 53.02,24.77 53.98,24.77 v54.29,24.45
GND  (via drill 0.5, 0.6)
  Top 0.406: C13.2 C14.2 29.21,19.58 v29.21,20.64
  Top 0.61: C15.2 32.54,29.84 v32.54,28.89
  Top 1.016: v38.73,35.24 v40.01,35.24 v41.27,35.24 40.01,33.97
  Top 2.184: 40.32,4.76 40.64,4.45 M1.15
  Top 2.54: C4.- 32.74,3.21 33.02,3.49 | 33.02,3.49 34.92,5.4 | 34.92,5.4 39.69,5.4 40.32,4.76 | 34.92,5.4 33.02,7.3 | 33.02,7.3 33.02,14.29 38.42,19.68 M1.9 41.91,31.43 40.01,31.43 | 33.02,7.3 33.02,3.49
  Top 3: 40.01,20.32 40.01,31.43 40.01,33.97
  Bottom 0.61: C16.2 24.32,20.65 IC1.16 27.8,24.13 v28.26,24.13 | IC1.28 26.04,29.84 | IC1.39 32.38,29.84 32.38,28.89 v32.54,28.89
  Bottom 0.813: C1.2 81.38,7.94
  Bottom 2.184: 81.38,7.94 M2.9 | M2.15 80.64,23.18 79.69,24.13 75.88,24.13
  Bottom 2.4: 45.09,19.68 40.96,19.68
  Bottom 3: 75.88,24.13 75.88,21.91 74.3,20.32 74.3,11.11 77.79,7.62 81.6,7.62
  other vias: 14.61,19.37 16.51,16.19 26.35,29.84 25.72,17.78 9.53,24.77 9.53,30.48 25.72,16.51 47.94,36.51 43.18,33.34 49.21,39.05 23.5,26.67 28.57,31.11 29.84,31.11 25.08,25.4 26.35,26.67 50.48,36.51 46.67,36.51 22.86,36.2 29.21,32.07 49.21,36.51 47.94,37.78 49.21,37.78 45.4,37.78 46.67,37.78 42.23,34.29 48.9,3.17 48.9,5.71 48.9,8.26 48.9,10.79 48.9,13.34 48.9,15.88 48.9,18.41 23.18,8.89 24.77,13.34 34.29,15.24 39.05,18.73 30.48,0.95 30.48,4.13 34.92,4.13 34.92,0.95 32.7,4.13 30.48,2.54 34.92,2.54 43.18,8.26 43.18,10.79 43.18,13.34 43.18,15.88 39.05,15.88 23.81,36.2 24.77,36.2 34.92,36.04 84.14,36.2 84.14,31.75 82.23,36.2 80.33,36.2 80.33,33.97 80.33,31.75 82.23,31.75 10.79,47.94 10.79,46.35 12.7,45.09 14.61,45.09 17.46,47.94 20,47.94 23.5,47.94 26.04,47.94 28.57,47.94 31.11,47.94 36.2,47.94 38.73,47.94 41.27,47.94 33.66,43.18 7.94,33.34 8.89,40.96 8.89,43.18 10.79,43.18 20,41.59 1.27,21.59 8.26,6.99 1.27,9.53 1.27,13.34 1.27,1.27 22.23,1.59 19.68,1.59 17.14,1.59 14.61,1.59 12.06,1.59 9.53,1.59 6.99,1.59 24.77,1.59 27.3,1.59 62.23,6.99 67.31,10.16 76.83,1.59 61.59,2.54 73.66,15.24 73.66,17.78 73.66,20.32 76.2,25.4 78.74,25.4 66.04,33.02 66.04,35.56 78.74,45.72 81.28,43.18 83.82,40.64 81.28,40.64 78.74,43.18 76.2,48.26 76.2,45.72 83.82,38.1 6.99,30.48 6.99,20.32 8.89,17.46 5.4,13.65 1.91,35.56 4.45,35.56 6.67,35.56 17.46,41.59 10.79,41.59 7.3,39.37 8.26,47.94 5.71,47.94 31.75,12.7 16.51,5.08 19.05,5.08 21.59,5.08 24.13,5.08 63.18,12.06 57.15,11.75 67.31,14.29 52.07,11.75 56.52,20 56.52,16.19 66.04,38.1 66.04,40.64 12.7,12.38 63.18,13.34 60.01,0.95 62.55,1.59 67.31,1.59 72.07,1.59 48.9,17.14 40.01,19.68 43.18,18.41 80.96,24.13 80.96,22.54 80.33,25.4 64.45,26.67 66.99,26.67 65.72,26.67 62.55,20 62.55,18.1 62.55,16.19 66.04,11.43 67.94,7.94 69.22,5.4 67.94,2.86 61.28,8.26 57.15,13.02 56.52,18.1 10.79,13.65 5.4,11.43 18.41,16.19 24.63,20.81 20.18,20.81 15.56,10.16
  pour Bottom (isolate 0.203): -2.54,50.8 86.36,50.8 86.36,-2.54 -2.54,-2.54
  pour Top (isolate 0.203): -2.54,50.8 86.36,50.8 86.36,-2.54 -2.54,-2.54
  pour Bottom (isolate 0.203, no thermals): 78.74,43.18 76.2,43.18 71.12,38.1 71.12,33.02 81.28,33.02 81.28,40.64
IO0  (via drill 0.5)
  Top 0.406: ST4.1 20.64,14.29 v23.18,14.29 30.16,14.29 31.75,15.88 31.75,17.78 33.97,20 v33.97,20.95
  Bottom 0.406: R21.1 20.64,21.91 21.05,21.49 21.05,17.68 22.86,15.88 22.86,14.61 v23.18,14.29 | v33.97,20.95 33.66,20.64 32.98,20.64 IC1.8
IO1  (via drill 0.5)
  Top 0.406: v33.97,26.67 34.61,26.04 34.61,23.18 35.88,21.91 36.51,21.91 37.78,23.18 v37.78,24.77 | v53.34,23.81 53.34,24.77 55.24,26.67 60.01,26.67 61.59,25.08 61.59,10.48 v61.91,10.16
  Bottom 0.406: IC1.27 25.86,28.89 26.99,28.89 27.62,29.53 30.48,29.53 33.34,26.67 v33.97,26.67 | v37.78,24.77 38.1,24.45 47.62,24.45 48.58,23.5 53.02,23.5 v53.34,23.81 | v61.91,10.16 Q2.1
IO1-OD
  Bottom 0.406: Q2.3 64.18,7.75 EXT-IO.3
IO2
  Bottom 0.406: IC1.29 24.94,32.07 24.77,32.07 20,27.3 20,24.34 R21.2
IO3-MISO  (via drill 0.5)
  Top 0.406: v36.83,23.81 36.2,23.81 35.88,24.13 35.88,26.04 36.2,26.35 36.2,31.43 28.89,38.73 PROG.1
  Bottom 0.406: IC1.2 36.59,23.81 v36.83,23.81 | PROG.1 28.89,38.73 25.4,35.24 23.18,35.24 16.83,28.89 16.83,18.1 14.76,16.03 | 14.76,16.03 11.13,12.4 HCSPEED.3 | R23.2 15.24,15.56 14.76,16.03
IO4
  Bottom 0.406: R23.1 15.24,13.65 15.56,13.34 15.56,12.38 16.51,11.43 16.51,7.62 17.14,6.99 18.41,6.99 19.05,7.62 21.27,7.62 22.23,8.57 22.23,9.21 23.5,10.48 23.5,13.34 24.13,13.97 24.13,14.61 23.5,15.24 23.5,16.19 21.69,18 21.69,21.37 22.86,22.54 23.95,22.54 IC1.18
MCLR
  Top 0.406: ICSP.1 9.38,20.71 R18.1 9.31,19.9 9.84,19.37 11.75,19.37 13.65,21.27 15.88,21.27 16.51,21.91 16.51,26.04 17.6,27.12 IC2.4
MS1-1  (via drill 0.5)
  Top 0.406: SJ1.1 58.42,4.45 59.69,5.71 59.69,23.5 v59.37,23.81
  Bottom 0.406: IC1.44 36.46,27.62 38.73,27.62 40.01,26.35 48.58,26.35 49.53,25.4 50.16,25.4 50.8,26.04 51.44,26.04 52.07,25.4 54.61,25.4 55.24,24.77 55.24,24.13 55.88,23.5 59.05,23.5 v59.37,23.81
MS1-2
  Bottom 0.406: IC1.11 31.49,18.73 35.56,18.73 39.37,22.54 46.67,22.54 47.62,21.59 64.77,21.59 66.36,23.18 SJ2.1
MS2-1  (via drill 0.5)
  Top 0.406: M1.3 50.8,10.79 50.8,19.05 49.85,20 v49.85,26.35
  Bottom 0.406: IC1.43 36.27,29.21 38.1,29.21 40.32,26.99 49.21,26.99 v49.85,26.35
MS2-2
  Bottom 0.406: IC1.34 31.49,34.61 35.24,34.61 36.83,33.02 40.01,33.02 42.23,30.8 52.39,30.8 53.98,29.21 60.64,29.21 64.14,25.72 67.31,25.72 69.53,27.94 71.12,27.94 72.39,26.67 72.39,22.54 70.48,20.64 M2.3
MS3-1  (via drill 0.5)
  Top 0.406: M1.4 SJ1.3 58.42,10.16 58.42,22.54 56.52,24.45 v56.2,24.45
  Bottom 0.406: IC1.42 35.78,29.84 38.42,29.84 40.64,27.62 50.8,27.62 52.39,26.04 54.93,26.04 56.2,24.77 v56.2,24.45
MS3-2
  Bottom 0.406: IC1.35 31.99,33.97 34.92,33.97 36.51,32.38 39.69,32.38 41.91,30.16 52.07,30.16 53.66,28.57 60.33,28.57 63.82,25.08 67.63,25.08 69.85,27.3 70.8,27.3 71.75,26.35 71.75,22.86 70.8,21.91 69.53,21.91 68.58,20.95 68.58,19.68 | 68.58,19.68 M2.4 | 68.58,19.68 SJ2.3
MS13-1
  Top 0.406: M1.2 55.24,4.45 SJ1.2
MS13-2
  Top 0.406: M2.2 69.53,23.18 SJ2.2
N$1
  Bottom 0.406: R2.1 2.67,8.57 HCSPEED.1
PWM  (via drill 0.5)
  Top 0.406: v33.66,28.57 33.66,30.8 v29.84,34.61
  Bottom 0.406: IC1.41 33.66,28.85 v33.66,28.57 | v29.84,34.61 28.89,35.56 28.89,36.83 37.2,45.13 Q1.1
PWM-OD
  Bottom 0.813: Q1.3 39.37,39.5 PWM.3
PWM-RES
  Bottom 0.813: Q1.2 42.18,45.13 R22.2
PWRLED
  Top 0.406: R14.2 61.49,33.55 PWR.A
RA+/SO
  Bottom 0.406: IC1.30 25.44,32.7 24.45,32.7 19.37,27.62 19.37,18.41 22.23,15.56 22.23,13.97 22.86,13.34 22.86,10.79 21.59,9.53 21.59,8.89 20.95,8.26 ST4.6
RA-1A
  Top 1.93: JP1.4 79.38,20.64 80.64,19.37 80.64,16.51 81.6,15.56 M2.12
RA-1B
  Bottom 1.93: JP1.1 M2.11
RA-2A
  Bottom 1.93: JP1.2 79.69,15.56 82.23,18.1 M2.13
RA-2B
  Bottom 1.93: JP1.3 79.06,18.1 81.6,20.64 M2.14
RA-/!SS
  Bottom 0.406: IC1.33 26.93,34.61 23.5,34.61 17.46,28.57 17.46,14.92 16.51,13.97 16.51,12.7 17.14,12.06 ST4.3
RESET  (via drill 0.5)
  Top 0.406: v24.13,27.62 23.07,27.62 C9.2 | PROG.5 23.81,39.05 24.45,38.42 26.04,38.42 28.89,35.56 30.16,35.56 34.92,30.8 34.92,28.26 34.29,27.62 33.66,27.62 32.7,26.67 | R20.1 32.7,26.67 | 32.7,26.67 32.7,25.72 v33.66,24.77
  Bottom 0.406: v24.13,27.62 27.62,27.62 28.26,28.26 29.84,28.26 33.34,24.77 v33.66,24.77 33.66,24.49 IC1.4
RX  (via drill 0.5)
  Top 0.406: v29.21,26.67 29.21,29.21 25.72,32.7 24.34,32.7 R16.1
  Bottom 0.406: IC1.7 32.05,22.7 31.73,22.7 29.84,24.59 29.84,26.04 v29.21,26.67
RX(USB)
  Top 0.406: IC2.12 16.72,30.37 18.1,31.75 20,31.75 20.95,32.7 R16.2
STAT-SCLK  (via drill 0.5)
  Top 0.406: v36.2,22.86 35.88,22.86 35.24,23.5 35.24,26.35 35.56,26.67 35.56,31.11 30.16,36.51 v29.84,36.51 28.89,36.51 26.35,39.05 PROG.3 | v56.2,31.43 56.62,31.85 R13.1
  Bottom 0.406: IC1.3 36.2,23.08 v36.2,22.86 | v29.84,36.51 30.16,36.51 31.43,35.24 35.56,35.24 35.88,34.92 37.47,34.92 38.1,34.29 40.64,34.29 42.86,32.07 43.5,32.07 44.77,33.34 54.93,33.34 56.2,32.07 v56.2,31.43
STATLED
  Top 0.406: R13.2 55.78,33.55 STAT.A
STEP-1  (via drill 0.5)
  Top 0.406: v51.12,25.08 51.12,20.64 M1.7
  Bottom 0.406: v51.12,25.08 50.8,24.77 49.21,24.77 48.26,25.72 39.69,25.72 38.73,26.67 35.56,26.67 34.61,25.72 33.34,25.72 30.16,28.89 27.94,28.89 27.3,28.26 25.36,28.26 IC1.26
STEP-2  (via drill 0.5)
  Top 0.406: M2.7 69.85,10.48 64.14,16.19 64.14,22.23 v63.82,22.54
  Bottom 0.406: IC1.10 31.99,19.37 35.24,19.37 39.05,23.18 46.99,23.18 47.94,22.23 63.5,22.23 v63.82,22.54
SWITCH
  Bottom 3: D1.C 64.88,46.35 60.64,46.35 58.74,44.45 | 58.74,44.45 55.56,41.27 | 55.56,41.27 PWR-SW.COM | 55.56,41.27 PWR-SW.NO 58.74,41.53 58.74,44.45
TX  (via drill 0.5)
  Top 0.406: v27.94,26.67 28.26,26.99 28.26,29.21 26.35,31.11 R15.1
  Bottom 0.406: v27.94,26.67 27.94,26.99 28.57,27.62 29.53,27.62 33.34,23.81 33.34,23.67 IC1.5
TX(USB)
  Top 0.406: IC2.10 20.97,31.02 R15.2
USBLED
  Bottom 0.406: R19.1 48.51,32 USB.A
USBOSC1
  Top 0.406: IC2.2 20.21,25.82 20.64,25.4 20.64,23.5 20.32,23.18 19.43,23.18 X2.2 18.8,22.29 17.88,21.38 C8.1
USBOSC2
  Top 0.406: IC2.3 20.52,26.47 21.27,25.72 21.27,23.5 21.59,23.18 22.16,23.18 X2.1 23.07,22.26 C7.1
USBSTAT  (via drill 0.5)
  Top 0.406: v37.15,33.97 35.56,33.97 31.11,38.42 31.11,43.5 29.84,44.77 27.94,44.77 27.3,45.4 v24.13,45.4 | v15.24,28.26 14.76,27.77 IC2.16
  Bottom 0.406: v37.15,33.97 37.47,33.66 40.32,33.66 42.55,31.43 44.55,31.43 R19.2 | v24.13,45.4 23.81,45.4 21.91,43.5 21.91,34.92 v15.24,28.26
V+
  Top 1.016: IC3.2 19.93,45.82 C10.1 22.64,45.82 23.5,46.67 29.53,46.67 32.23,43.97 32.23,38.89 33.81,37.31 36.86,37.31 PWM.2
  Top 1.778: PWM.2 37.27,37.02 37.47,36.83 42.86,36.83
  Top 1.93: 44.77,2.54 44.77,1.91 M1.16 38.06,1.91 C4.+
  Top 2.184: C2.+ 82.55,26.04 M2.16 83.19,26.04 83.19,27.94 82.23,28.89 81.28,28.89
  Top 3: PWR-SW.NC 49.59,44.39 47.62,46.35 44.77,46.35 42.86,44.45 42.86,36.83 45.4,34.29 45.4,28.89 | 45.4,28.89 45.4,3.17 44.77,2.54 | 45.4,28.89 81.28,28.89 82.55,27.62
VBUS
  Top 0.406: D2.2 4.33,31.31 USB->.1
VIN
  Bottom 3: D1.A 73.23,42.82 J1.CENTRE
VPIC
  Top 0.406: R18.2 10.88,20.77 ICSP.2 10.88,23.41 10.48,23.81 8.57,23.81 8.26,23.5 8.26,22.64 | IC2.1 18.19,25.17 17.14,24.13 17.14,21.59 16.19,20.64 13.97,20.64 12.06,18.73 8.57,18.73 8.26,19.05 8.26,22.23 | 8.26,22.23 8.26,22.64 | D2.1 2.02,22.74 2.54,22.23 8.26,22.23 | C5.1 8.26,22.64
VUSB
  Top 0.406: IC2.17 10.02,27.12 8.47,28.68 C6.2

### Text on the board
tPlace: =8834 | =882x/498x | Jumpers: | 1 2 3
tNames: 12V
bNames: Designed By | Thomas Carpenter | (C) 2013-26 | AstroEQ | V4.8-SMD | RA
Reference: This board design is for AstroEQ boards which fit inside the enclosure on an EQ5 Mount. | The board uses some very tricky surface mount components and is not recommended for DIY. | It is a 2 Layer board designed to be sent for manufacture. The AstroEQ-SMD-Gerber.zip file contains the required gerber files. | I use iteadstudio.com 10cm x 5cm prototype service, selecting 1.2mm thick, HASL, 100% electrical check